# Altium project Carrier-Board-v1.0.PrjPcb (part 9 of 15)

## Sheet WIFI_BLUETOOTH_SHEET.SchDoc
size A4; SheetNumber: 15; SheetTotal: 27
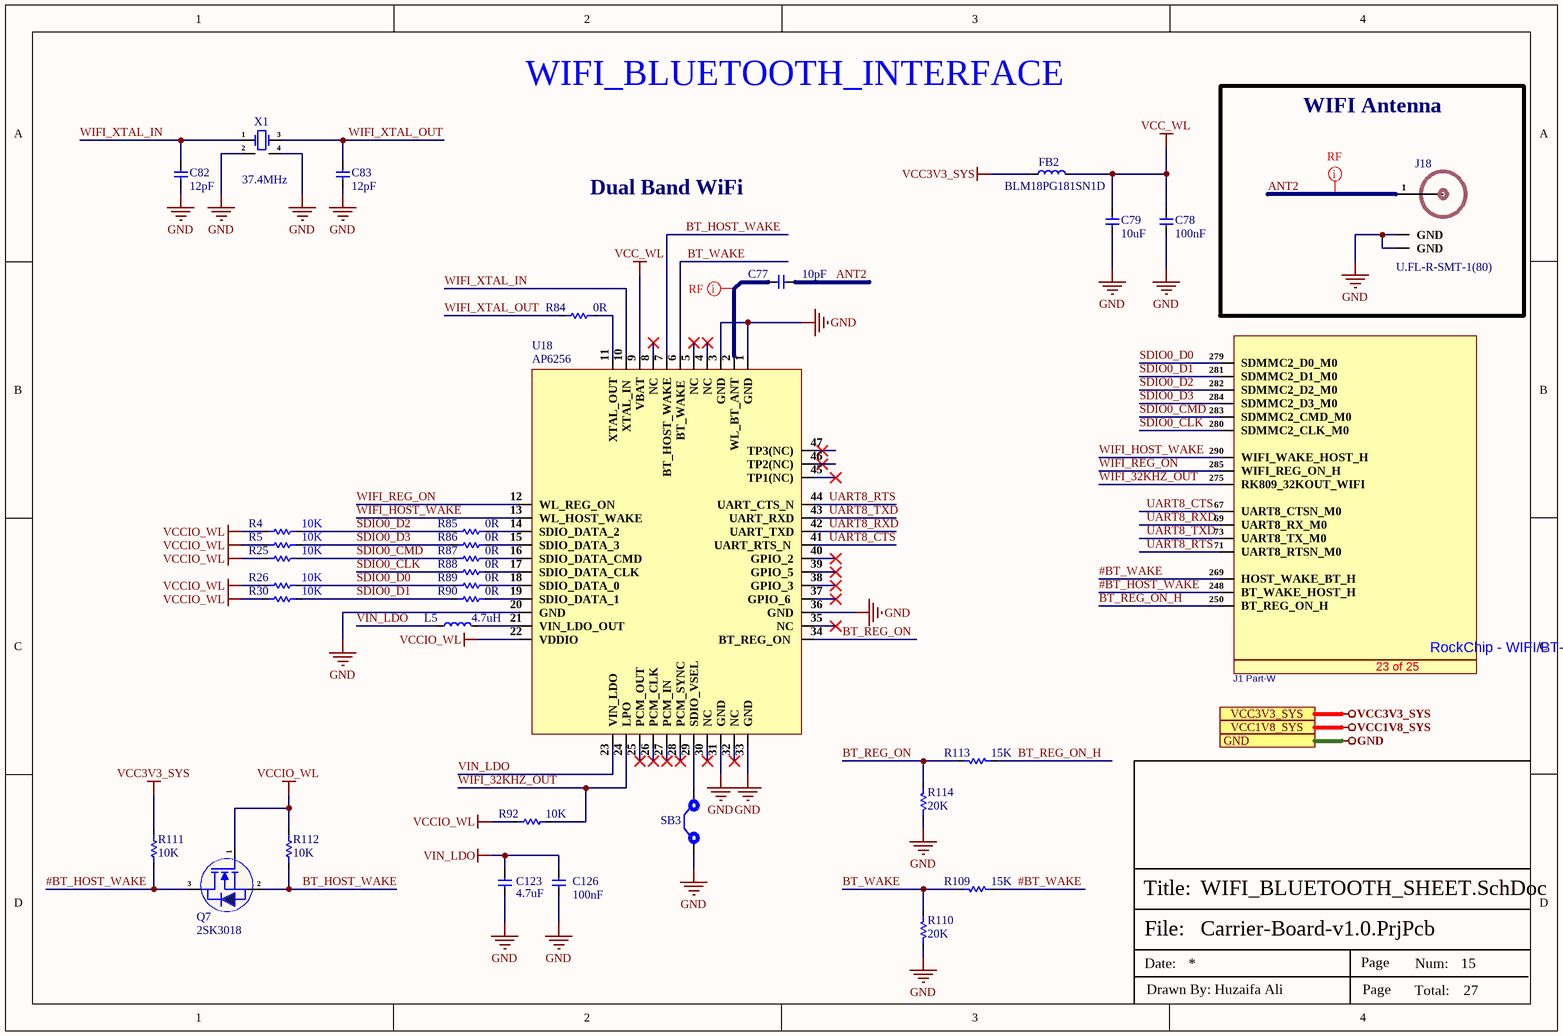
[diagram p14: WIFI_BLUETOOTH_SHEET.SchDoc]

### Parts
C77  10pF  [Cap-0402]
C78  100nF  [Cap-0402]
C79  10uF  [Cap-0402]
C82  12pF  [Cap-0402]
C83  12pF  [Cap-0402]
C123  4.7uF  [Cap-0402]
C126  100nF  [Cap-0402]
FB2  BLM18PG181SN1D  [IND-0603 (1608 Metric)]
J1_Part-  AS0B826-S78B-7H  [AS0B826-S78B-7H]  (value not drawn)  (part W of 25)
J18  U.FL-R-SMT-1(80)  [U.FL-R-SMT-1(80)_]
L5  4.7uH  [SWPA4030S4R7MT_]
Q7  2SK3018  [SOT-23]
R4  10K  [Res-0402]
R5  10K  [Res-0402]
R25  10K  [Res-0402]
R26  10K  [Res-0402]
R30  10K  [Res-0402]
R84  0R  [Res-0402]
R85  0R  [Res-0402]
R86  0R  [Res-0402]
R87  0R  [Res-0402]
R88  0R  [Res-0402]
R89  0R  [Res-0402]
R90  0R  [Res-0402]
R92  10K  [Res-0402]
R109  15K  [Res-0402]
R110  20K  [Res-0402]
R111  10K  [Res-0402]
R112  10K  [Res-0402]
R113  15K  [Res-0402]
R114  20K  [Res-0402]
SB3  Solder Bridge 0402  [Solder Bridge 0402]  (value not drawn)  (no BOM)
U18  AP6256  [AP6256_]
X1  37.4MHz  [Q22FA12800078_]

### Blocks framed on the sheet
WIFI Antenna: J18

### Ports
GND (see TOP SHEET[3C], AUDIO_INTERFACE[1D], BUCK REGULATOR[3D], DEBUG_UART_INTERFACE[3D], DIGITAL IO_RELAY_SHEET[5D], DUAL_SIM_INTERFACE[3D], ETHERNET_PHY0[4D], ETHERNET_PHY1[4D], GSM_INTERFACE[2D], HDMI_INTERFACE[3D], INPUT_PROTECTION[3D], LINEAR_VOLTAGE_REG[3D], MICRO_SD_INTERFACE[3D], MIPI-DSI DISPLAY[3D], POWER SECTION[3D], PUSH BUTTONs_INTERFACE[3C], RGB_LEDs_INTERFACE[3D], ROCKCHIP_PWR_SUPPLY[1D], ROCKCHIP_SYSTEM_CONTROL[3C], RS232_RS485_INTERFACE[3C], SENSOR_SHEET[3D], USB2.0_INTERFACE[3D], USB3.0_INTERFACE[3D], USB-C_INTERFACE[2D], WIEGAND_INTERFACE[3D]), VCC1V8_SYS (see TOP SHEET[3C], ETHERNET_PHY0[4D], ETHERNET_PHY1[4D], LINEAR_VOLTAGE_REG[3D], POWER SECTION[3D], ROCKCHIP_PWR_SUPPLY[1D]), VCC3V3_SYS (see TOP SHEET[3C], AUDIO_INTERFACE[1D], BUCK REGULATOR[3D], DEBUG_UART_INTERFACE[3D], DIGITAL IO_RELAY_SHEET[5D], ETHERNET_PHY0[4D], ETHERNET_PHY1[4D], GSM_INTERFACE[2D], HDMI_INTERFACE[3D], LINEAR_VOLTAGE_REG[3D], MIPI-DSI DISPLAY[3D], POWER SECTION[3D], PUSH BUTTONs_INTERFACE[3C], ROCKCHIP_PWR_SUPPLY[1D], ROCKCHIP_SYSTEM_CONTROL[3C], RS232_RS485_INTERFACE[3C], SENSOR_SHEET[3D], USB-C_INTERFACE[2D], WIEGAND_INTERFACE[3D])

### Nets
GND: C78.1 C79.1 C82.1 C83.1 C123.1 C126.1 J18.2(GND) J18.3(GND) R110.1 R114.1 SB3.2 U18.1(GND) U18.3(GND) U18.20(GND) U18.31(GND) U18.33(GND) U18.36(GND) X1.2(GND) X1.4(GND) ; port GND
VCC3V3_SYS: FB2.1 R111.2 ; port VCC3V3_SYS
VCC_WL: C78.2 C79.2 FB2.2 U18.9(VBAT)
VCCIO_WL: Q7.1(G) R4.2 R5.2 R25.2 R26.2 R30.2 R92.2 R112.2 U18.22(VDDIO)
VIN_LDO: C123.2 C126.2 L5.1 U18.23(VIN_LDO)
#BT_HOST_WAKE: J1_Part-.248(BT_WAKE_HOST_H) Q7.3(D) R111.1
#BT_WAKE: J1_Part-.269(HOST_WAKE_BT_H) R109.1
ANT2: C77.2 J18.1(RF_IN)
BT_HOST_WAKE: Q7.2(S) R112.1 U18.7(BT_HOST_WAKE)
BT_REG_ON: R113.2 R114.2 U18.34(BT_REG_ON)
BT_REG_ON_H: J1_Part-.250(BT_REG_ON_H) R113.1
BT_WAKE: R109.2 R110.2 U18.6(BT_WAKE)
SDIO0_CLK: J1_Part-.280(SDMMC2_CLK_M0) R88.1
SDIO0_CMD: J1_Part-.283(SDMMC2_CMD_M0) R25.1 R87.1
SDIO0_D0: J1_Part-.279(SDMMC2_D0_M0) R26.1 R89.1
SDIO0_D1: J1_Part-.281(SDMMC2_D1_M0) R30.1 R90.1
SDIO0_D2: J1_Part-.282(SDMMC2_D2_M0) R4.1 R85.1
SDIO0_D3: J1_Part-.284(SDMMC2_D3_M0) R5.1 R86.1
UART8_CTS: J1_Part-.67(UART8_CTSN_M0) U18.41(UART_RTS_N)
UART8_RTS: J1_Part-.71(UART8_RTSN_M0) U18.44(UART_CTS_N)
UART8_RXD: J1_Part-.69(UART8_RX_M0) U18.42(UART_TXD)
UART8_TXD: J1_Part-.73(UART8_TX_M0) U18.43(UART_RXD)
WIFI_32KHZ_OUT: J1_Part-.275(RK809_32KOUT_WIFI) R92.1 U18.24(LPO)
WIFI_HOST_WAKE: J1_Part-.290(WIFI_WAKE_HOST_H) U18.13(WL_HOST_WAKE)
WIFI_REG_ON: J1_Part-.285(WIFI_REG_ON_H) U18.12(WL_REG_ON)
WIFI_XTAL_IN: C82.2 U18.10(XTAL_IN) X1.1(OSC1)
WIFI_XTAL_OUT: C83.2 R84.1 X1.3(OSC2)
NetC77_1: C77.1 U18.2(WL_BT_ANT)
NetL5_2: L5.2 U18.21(VIN_LDO_OUT)
NetR84_2: R84.2 U18.11(XTAL_OUT)
NetR85_2: R85.2 U18.14(SDIO_DATA_2)
NetR86_2: R86.2 U18.15(SDIO_DATA_3)
NetR87_2: R87.2 U18.16(SDIO_DATA_CMD)
NetR88_2: R88.2 U18.17(SDIO_DATA_CLK)
NetR89_2: R89.2 U18.18(SDIO_DATA_0)
NetR90_2: R90.2 U18.19(SDIO_DATA_1)
NetSB3_1: SB3.1 U18.29(SDIO_VSEL)

Not connected (* = marked no-connect by the designer): U18 4(NC)* 5(NC)* 8(NC)* 25(PCM_OUT)* 26(PCM_CLK)* 27(PCM_IN_)* 28(PCM_SYNC_)* 30(NC)* 32(NC_)* 35(NC)* 37(GPIO_6_)* 38(GPIO_3)* 39(GPIO_5)* 40(GPIO_2)* 45(TP1(NC))* 46(TP2(NC))* 47(TP3(NC))*

### Layout directives
net class RF: ANT2, NetC77_1

### Notes on the sheet
- WIFI_BLUETOOTH_INTERFACE
- Dual Band WiFi
- File:
- Title:
- Date:
- Page
- Num:
- Total:
- Drawn By: Huzaifa Ali
- (in symbol AS0B826-S78B-7H, part W) RockChip - WIFI/BT-SDIO; 23 of 25

### Library data of the parts
C77 = GRM1555C1H100JA01D: CAP CER 10PF 50V C0G/NP0 0402; Manufacturer: Murata; Tolerance: 5%; Material: Ceramic; Dielectric: C0G; Item Type: Capacitor; Manufacturer Part Number: GRM1555C1H100JA01D; RoHS: Yes; Category: Ceramic Capacitors; Case/Package: 0402; Case Code (Imperial): 0402; Case Code (Metric): 1005; Min Operating Temperature: -55°C; Max Operating Temperature: 125°C; Packaging: Tape and Reel; Voltage Rating: 50V; RoHS Compliant: Yes; ComponentLink1URL: https://datasheet.ciiva.com/2989/product-2989280.pdf?src-supplier=Avnet; ComponentLink1Description: https://datasheet.ciiva.com/2989/product-2989280.pdf?src-supplier=Avnet; Supplier: Arrow Electronics; Supplier Part Number: GRM1555C1H100JA01D; Stock: 3860000; Pricing: 10000=0.0034, 50000=0.0027, 100000=0.0023, 250000=0.0021 (USD); Mounting Technology: Surface Mount; Value: 10pF; Package Quantity: 1; Voltage Rating (DC): 50V; Termination: SMD/SMT; Series: GRM; Voltage: 50V; Construction: Flat; Length: 1mm; Width: 0.02inch; Height: 0.5mm; Depth: 0.5mm; Thickness: 0.022inch; Radiation Hardening: No; Lead Free: Lead Free; Reach SVHC Compliant: No; ComponentLink2URL: https://datasheet.ciiva.com/18184/getdatasheetpartid-307234-18184164.pdf?src-supplier=Verical; ComponentLink2Description: https://datasheet.ciiva.com/18184/getdatasheetpartid-307234-18184164.pdf?src-supplier=Verical; ComponentLink3URL: https://datasheet.ciiva.com/29200/453545-da-01-en-vs-kondensator-0402-29200107.pdf?src-supplier=Conrad; ComponentLink3Description: https://datasheet.ciiva.com/29200/453545-da-01-en-vs-kondensator-0402-29200107.pdf?src-supplier=Conrad; ComponentLink4URL: https://datasheet.ciiva.com/7828/1666664-7828812.pdf?src-supplier=Element14; ComponentLink4Description: https://datasheet.ciiva.com/7828/1666664-7828812.pdf?src-supplier=Element14; ComponentLink5URL: https://datasheet.ciiva.com/6271/partnumbering-e-01-6271159.pdf?src-supplier=Digi-Key; ComponentLink5Description: https://datasheet.ciiva.com/6271/partnumbering-e-01-6271159.pdf?src-supplier=Digi-Key; ComponentLink6URL: https://datasheet.ciiva.com/6271/partnumbering-e-01-6271158.pdf?src-supplier=Digi-Key; ComponentLink6Description: https://datasheet.ciiva.com/6271/partnumbering-e-01-6271158.pdf?src-supplier=Digi-Key; ComponentLink7URL: https://datasheet.ciiva.com/6271/partnumbering-e-01-6271068.pdf?src-supplier=Digi-Key; ComponentLink7Description: https://datasheet.ciiva.com/6271/partnumbering-e-01-6271068.pdf?src-supplier=Digi-Key; LCSC Part Number: C76946
C78 C126 = CC0402KRX5R7BB104: CAP CER 0.1UF 16V X5R 0402; Manufacturer: Yageo; Tolerance: 10%; Supplier 1: Mouser; Manufacturer Part Number: CC0402KRX5R7BB104; RoHS: Yes; Category: Ceramic Capacitors; Stock 1: 936792; Pricing 1: 1=0.10000, 10=0.02300, 50=0.02300, 100=0.01100, 1000=0.00600, 10000=0.00400 (USD); Mount: Surface Mount; Case/Package: 0402; Case Code (Imperial): 0402; Case Code (Metric): 1005; Min Operating Temperature: -55°C; Max Operating Temperature: 85°C; Capacitance: 100nF; Packaging: Tape and Reel; Voltage Rating: 16V; Dielectric: X5R; Termination: SMD/SMT; Voltage Rating (DC): 16V; Package Quantity: 1; Length: 1mm; Width: 0.02inch; Thickness: 0.022inch; Lead Free: Lead Free; Halogen Free: Halogen Free; ComponentLink1URL: https://datasheet.ciiva.com/155/mlccorderingcode-155879.pdf?src-supplier=Digi-Key; ComponentLink1Description: https://datasheet.ciiva.com/155/mlccorderingcode-155879.pdf?src-supplier=Digi-Key; ComponentLink2URL: https://datasheet.ciiva.com/155/mlccorderingcode-155878.pdf?src-supplier=Digi-Key; ComponentLink2Description: https://datasheet.ciiva.com/155/mlccorderingcode-155878.pdf?src-supplier=Digi-Key; ComponentLink3URL: https://datasheet.ciiva.com/155/mlccorderingcode-155880.pdf?src-supplier=Digi-Key; ComponentLink3Description: https://datasheet.ciiva.com/155/mlccorderingcode-155880.pdf?src-supplier=Digi-Key; Supplier Part Number 1: 603-CC402KRX5R7BB104; LCSC Part Number: C106204; Number of Pins: 2; Resistor Type: Ceramic; Series: CC; Construction: Flat; Height: 0.5mm; Depth: 0.5mm; Radiation Hardening: No; REACH SVHC: Unknown; RoHS Compliant: Yes; ComponentLink4URL: https://datasheet.ciiva.com/11464/upy-gphc-x5r-4v-to-50v-12-11464869.pdf?src-supplier=Avnet; ComponentLink4Description: https://datasheet.ciiva.com/11464/upy-gphc-x5r-4v-to-50v-12-11464869.pdf?src-supplier=Avnet
C79 = CC0402MRX5R6BB106: CAP CER 10UF 10V X5R 0402; Manufacturer: Yageo; Tolerance: 20%; Item Type: Capacitor; Supplier 1: Future Electronics; Manufacturer Part Number: CC0402MRX5R6BB106; RoHS: Yes; Category: Ceramic Capacitors; Stock 1: 80000; Pricing 1: 10000=0.02650, 20000=0.02590, 30000=0.02550, 40000=0.02530, 50000=0.02450 (USD); Mount: Surface Mount; Case/Package: 0402; Case Code (Imperial): 0402; Case Code (Metric): 1005; Min Operating Temperature: -55°C; Max Operating Temperature: 85°C; Packaging: Tape and Reel; Capacitance: 10uF; Voltage Rating: 10V; RoHS Compliant: Yes; ComponentLink1URL: http://www.yageo.com/documents/recent/UPY-GPHC_X5R_4V-to-50V_25.pdf?src-supplier=Digi-Key; ComponentLink1Description: http://www.yageo.com/documents/recent/UPY-GPHC_X5R_4V-to-50V_25.pdf?src-supplier=Digi-Key; Supplier Part Number 1: 6097631; LCSC Part Number: C962143
C82 C83 = GJM1555C1H120GB01D: CAP CER 12PF 50V C0G/NP0 0402; Manufacturer: Murata; Tolerance: 2%; Dielectric: C0G; Supplier 1: Digi-Key; Manufacturer Part Number: GJM1555C1H120GB01D; RoHS: Yes; Category: Ceramic Capacitors; Stock 1: 266975; Pricing 1: 1=0.18000, 10=0.12600, 50=0.07560, 100=0.06390, 500=0.04370, 1000=0.03865, 2500=0.03698, 5000=0.03361 (USD); Mount: Surface Mount; Case/Package: 0402; Case Code (Imperial): 0402; Case Code (Metric): 1005; Min Operating Temperature: -55°C; Max Operating Temperature: 125°C; Capacitance: 12pF; Voltage Rating: 50V; Voltage Rating (DC): 50V; Packaging: Tape and Reel; Package Quantity: 10000; Termination: SMD/SMT; Series: GJM; Construction: Flat; Length: 1mm; Width: 0.5mm; Height: 0.5mm; Thickness: 0.022inch; Depth: 0.5mm; Radiation Hardening: No; Lead Free: Lead Free; RoHS Compliant: Yes; ComponentLink1URL: https://datasheet.ciiva.com/11608/product-11608208.pdf?src-supplier=Avnet; ComponentLink1Description: https://datasheet.ciiva.com/11608/product-11608208.pdf?src-supplier=Avnet; ComponentLink2URL: https://datasheet.ciiva.com/29542/partnumbering-e-01-29542716.pdf?src-supplier=Digi-Key; ComponentLink2Description: https://datasheet.ciiva.com/29542/partnumbering-e-01-29542716.pdf?src-supplier=Digi-Key; ComponentLink3URL: https://datasheet.ciiva.com/29542/partnumbering-e-01-29542715.pdf?src-supplier=Digi-Key; ComponentLink3Description: https://datasheet.ciiva.com/29542/partnumbering-e-01-29542715.pdf?src-supplier=Digi-Key; ComponentLink4URL: https://datasheet.ciiva.com/29542/partnumbering-e-01-29542717.pdf?src-supplier=Digi-Key; ComponentLink4Description: https://datasheet.ciiva.com/29542/partnumbering-e-01-29542717.pdf?src-supplier=Digi-Key; Supplier Part Number 1: 490-8078-1-ND; LCSC Part Number: C161305
C123 = CC0402KRX5R6BB475: CAP CER 4.7UF 10V X5R 0402; Manufacturer: Yageo; Tolerance: 10%; Supplier 1: Farnell; Manufacturer Part Number: CC0402KRX5R6BB475; RoHS: Yes; Category: Ceramic Capacitors; Stock 1: 20000; Pricing 1: 10000=0.02310, 50000=0.02100 (GBP); RoHS Compliant: Yes; Supplier Part Number 1: 3871698; LCSC Part Number: C326586; ComponentLink1Description: http://www.yageo.com/documents/recent/UPY-GPHC_X5R_4V-to-50V_25.pdf?src-supplier=Digi-Key; ComponentLink1URL: http://www.yageo.com/documents/recent/UPY-GPHC_X5R_4V-to-50V_25.pdf?src-supplier=Digi-Key; Mount: Surface Mount; Case/Package: 0402; Case Code (Imperial): 0402; Case Code (Metric): 1005; Min Operating Temperature: -55°C; Max Operating Temperature: 85°C; Packaging: Cut Tape; Capacitance: 4.7uF; Voltage Rating: 10V
FB2 = BLM18PG181SN1D: 0603 180Ω ±25% DCR=0.09Ω 1.5A; Manufacturer: Murata; Manufacturer Series: BLM18P; Core Material: Ferrite; Material: Ferrite,Steel; Impedance: 180R; Number of Lines: 1; DC Resistance (DCR): 90mR; Test Frequency: 100MHz; Shielding: Unshielded; Item Type: Ferrite Bead; Supplier 1: Arrow Electronics; Manufacturer Part Number: BLM18PG181SN1D; RoHS: Yes; Category: Inductors; Stock 1: 13; Pricing 1: 1=0.08740, 10=0.06280 (USD); Case/Package: 0603; Number of Pins: 2; Case Code (Metric): 1608; Case Code (Imperial): 0603; Terminal Finish: Tin; Min Operating Temperature: -55°C; Max Operating Temperature: 125°C; Package Quantity: 1; Tolerance: 25%; Packaging: Tape and Reel; Current Rating: 1.5A; Max Current Rating: 1.5A; Max DC Current: 1.5A; Termination: SMD/SMT; DC Current: 1.5A; Number of Circuits: 1; Series: BLM18P; Number of Functions: 1; DC Resistance-Max: 90mR; Length: 1.6mm; Width: 0.8mm; Height: 0.8mm; Depth: 0.8mm; Radiation Hardening: No; REACH SVHC: No SVHC; Lead Free: Lead Free; RoHS Compliant: Yes; ComponentLink1URL: https://datasheet.ciiva.com/36526/1845021-36526048.pdf?src-supplier=Jameco; ComponentLink1Description: https://datasheet.ciiva.com/36526/1845021-36526048.pdf?src-supplier=Jameco; ComponentLink2URL: https://datasheet.ciiva.com/11800/0900766b81275ca5-11800854.pdf?src-supplier=RSComponents; ComponentLink2Description: https://datasheet.ciiva.com/11800/0900766b81275ca5-11800854.pdf?src-supplier=RSComponents; ComponentLink3URL: https://datasheet.ciiva.com/29347/442378-da-01-en-chip-drossel-0603-180r-1500ma-1-6x0-8mm-29347913.pdf?src-supplier=Conrad; ComponentLink3Description: https://datasheet.ciiva.com/29347/442378-da-01-en-chip-drossel-0603-180r-1500ma-1-6x0-8mm-29347913.pdf?src-supplier=Conrad; ComponentLink4URL: https://datasheet.ciiva.com/8021/5148-8021478.pdf?src-supplier=Element14; ComponentLink4Description: https://datasheet.ciiva.com/8021/5148-8021478.pdf?src-supplier=Element14; ComponentLink5URL: https://datasheet.ciiva.com/8021/5148-8021496.pdf?src-supplier=Element14; ComponentLink5Description: https://datasheet.ciiva.com/8021/5148-8021496.pdf?src-supplier=Element14; ComponentLink6URL: https://datasheet.ciiva.com/1012/l0110s0100blm18p-1012153.pdf?src-supplier=Digi-Key; ComponentLink6Description: https://datasheet.ciiva.com/1012/l0110s0100blm18p-1012153.pdf?src-supplier=Digi-Key; ComponentLink7URL: https://datasheet.ciiva.com/1012/l0110s0100blm18p-1012152.pdf?src-supplier=Digi-Key; ComponentLink7Description: https://datasheet.ciiva.com/1012/l0110s0100blm18p-1012152.pdf?src-supplier=Digi-Key; ComponentLink8URL: https://datasheet.ciiva.com/1012/l0110s0100blm18p-1012154.pdf?src-supplier=Digi-Key; ComponentLink8Description: https://datasheet.ciiva.com/1012/l0110s0100blm18p-1012154.pdf?src-supplier=Digi-Key; ComponentLink9URL: https://datasheet.ciiva.com/8084/l0110s0100blm18p-8084296.pdf?src-supplier=Avnet; ComponentLink9Description: https://datasheet.ciiva.com/8084/l0110s0100blm18p-8084296.pdf?src-supplier=Avnet; ComponentLink10URL: https://datasheet.ciiva.com/16394/l0110s0100blm18p-16394029.pdf?src-supplier=Future+Electronics; ComponentLink10Description: https://datasheet.ciiva.com/16394/l0110s0100blm18p-16394029.pdf?src-supplier=Future+Electronics; Supplier Part Number 1: BLM18PG181SN1D; LCSC Part Number: C82850
J1_Part- = AS0B826-S78B-7H: SMD,P=0.5mm,Surface Mount，Right Angle; Manufacturer: FOXCONN; Item Type: Card Edge Connectors; Supplier: LCSC; Manufacturer Part Number: AS0B826-S78B-7H; RoHS: No; Stock: 4979; Pricing: 1=9.21, 10=8.287, 25=7.8064, 50=7.6064, 100=7.4062 (USD); LCSC Part Number: C426232
J18 = U.FL-R-SMT-1(80): CONN U.FL RCPT STR 50 OHM SMD; Manufacturer: Hirose; Item Type: UFL Connector; Supplier 1: Future Electronics; Manufacturer Part Number: U.FL-R-SMT-1(80); Stock 1: 1272; Pricing 1: 1=1.07, 500=0.785, 1500=0.74, 2500=0.72, 5000=0.695 (USD); Case/Package: SMD/SMT; Package Quantity: 10000; Packaging: Tape and Reel; Lead Free: Lead Free; ComponentLink1URL: https://www.hirose.com/product/en/download_file/key_name/U.FL-R-SMT-1%2880%29/category/Specification%20Sheet/doc_file_id/37638/?file_category_id=9&item_id=03310472280&is_series=&src-supplier=Digi-Key; ComponentLink1Description: https://www.hirose.com/product/en/download_file/key_name/U.FL-R-SMT-1%2880%29/category/Specification%20Sheet/doc_file_id/37638/?file_category_id=9&item_id=03310472280&is_series=&src-supplier=Digi-Key; ComponentLink2URL: http://www.mouser.com/ds/2/185/U.FL_catalog-939761.pdf?src-supplier=Mouser; ComponentLink2Description: http://www.mouser.com/ds/2/185/U.FL_catalog-939761.pdf?src-supplier=Mouser; Supplier Part Number 1: U.FL-R-SMT-1(80)-CUTT; LCSC Part Number: C88374
L5 = SWPA4030S4R7MT: Fixed Ind 4.720%UH 0.06 Ohm 3200M; Manufacturer: Sunlord; Supplier 1: Digi-Key; Manufacturer Part Number: SWPA4030S4R7MT; RoHS: Yes; Category: Fixed Inductors; Stock 1: 3730; Pricing 1: 1=0.44000, 10=0.38900, 25=0.36120, 50=0.30560, 100=0.27780, 250=0.26108, 500=0.23332, 1000=0.18887 (USD); RoHS Compliant: Yes; Supplier Part Number 1: 3442-SWPA4030S4R7MTCT-ND; LCSC Part Number: C57269
Q7 = 2SK3018: 30V 100mA 200mW 8Ω@4V,10mA N Channel SOT-23 MOSFETs ROHS; Manufacturer: KUU; Item Type: MOSFET; Manufacturer Part Number: 2SK3018; Package: SOT-23; LCSC Part Number: C2944164; ComponentLink1Description: LCSC; ComponentLink1URL: https://www.lcsc.com/product-detail/MOSFETs_KUU-2SK3018_C2944164.html
R4 R5 R25 R26 R30 R92 R111 R112 = RC0402FR-0710KL: RES 10K OHM 1% 1/16W 0402; Manufacturer: Yageo; Max Power Dissipation: 63mW; Temperature Coefficient: 100ppm/°C; Resistance: 10kR; Voltage Rating (DC): 50V; Power Rating: 62.5mW; Item Type: Resistor; Manufacturer Part Number: RC0402FR-0710KL; RoHS: Yes; Category: Chip SMD Resistors; Case/Package: 0402; Case Code (Imperial): 0402; Case Code (Metric): 1005; Min Operating Temperature: -55°C; Max Operating Temperature: 155°C; Features: Moisture Resistant; Packaging: Tape and Reel; Tolerance: 1%; Number of Terminations: 2; Series: RC; RoHS Compliant: Yes; ComponentLink1URL: https://datasheet.ciiva.com/7660/38568-7660787.pdf?src-supplier=Element14; ComponentLink1Description: https://datasheet.ciiva.com/7660/38568-7660787.pdf?src-supplier=Element14; Supplier 1: Mouser; Stock 1: 18648329; Pricing 1: 1=0.10000, 10=0.01400, 50=0.01400, 100=0.00500, 1000=0.00300, 10000=0.00200 (USD); Number of Pins: 2; Resistor Type: Thick Film; Voltage Rating: 50V; Termination: SMD/SMT; Resistance Tolerance: 1%; Construction: Rectangular; Length: 1mm; Width: 0.5mm; Height: 0.32mm; Depth: 0.5mm; Lead Pitch: 0.2mm; REACH SVHC: No SVHC; Lead Free: Lead Free; Military Standard: Not; ComponentLink2URL: https://datasheet.ciiva.com/7849/1686128-7849814.pdf?src-supplier=Element14; ComponentLink2Description: https://datasheet.ciiva.com/7849/1686128-7849814.pdf?src-supplier=Element14; ComponentLink3URL: https://datasheet.ciiva.com/7983/1018594-7983486.pdf?src-supplier=Element14; ComponentLink3Description: https://datasheet.ciiva.com/7983/1018594-7983486.pdf?src-supplier=Element14; ComponentLink4URL: https://datasheet.ciiva.com/22747/1018594-22747512.pdf?src-supplier=Element14; ComponentLink4Description: https://datasheet.ciiva.com/22747/1018594-22747512.pdf?src-supplier=Element14; ComponentLink5URL: https://datasheet.ciiva.com/12667/pyu-rc0402-51-rohs-l-6-r-12667067.pdf?src-supplier=Mouser; ComponentLink5Description: https://datasheet.ciiva.com/12667/pyu-rc0402-51-rohs-l-6-r-12667067.pdf?src-supplier=Mouser; ComponentLink6URL: https://datasheet.ciiva.com/7849/1784430-7849813.pdf?src-supplier=Element14; ComponentLink6Description: https://datasheet.ciiva.com/7849/1784430-7849813.pdf?src-supplier=Element14; Supplier Part Number 1: 603-RC0402FR-0710KL; LCSC Part Number: C60490; Working Voltage: 50V; ComponentLink7URL: https://datasheet.ciiva.com/7849/1784430-7849815.pdf?src-supplier=Element14; ComponentLink7Description: https://datasheet.ciiva.com/7849/1784430-7849815.pdf?src-supplier=Element14
R84 = RC0402FR-070RL: RES 0 OHM JUMPER 1/16W 0402; Manufacturer: Yageo; Tolerance: 1%; Power Rating: 62.5mW; Voltage Rating: 50V; Temperature Coefficient: 200ppm/°C; Max Power Dissipation: 63mW; Supplier 1: Mouser; Manufacturer Part Number: RC0402FR-070RL; RoHS: Yes; Category: Chip SMD Resistors; Stock 1: 8556842; Pricing 1: 1=0.10000, 10=0.01400, 50=0.01400, 100=0.00600, 1000=0.00300, 5000=0.00200, 10000=0.00100 (USD); Mount: Surface Mount; Case/Package: 0402; Contact Plating: Tin,Matte; Case Code (Imperial): 0402; Case Code (Metric): 1005; Size Code: 0402; Min Operating Temperature: -55°C; Max Operating Temperature: 155°C; Resistance: 0R; Resistor Type: Thick Film; Packaging: Tape and Reel; Termination: SMD/SMT; Features: Moisture Resistant; Series: RC; Number of Terminations: 2; Length: 1mm; Width: 0.5mm; Height: 0.35mm; Radiation Hardening: No; Lead Free: Lead Free; RoHS Compliant: Yes; ComponentLink1URL: https://datasheet.ciiva.com/8896/pyu-rc0402-51-rohs-l-6-8896149.pdf?src-supplier=Avnet; ComponentLink1Description: https://datasheet.ciiva.com/8896/pyu-rc0402-51-rohs-l-6-8896149.pdf?src-supplier=Avnet; ComponentLink2URL: https://datasheet.ciiva.com/16790/pyu-rc0402-51-rohs-l-6-r-16790444.pdf?src-supplier=Future+Electronics; ComponentLink2Description: https://datasheet.ciiva.com/16790/pyu-rc0402-51-rohs-l-6-r-16790444.pdf?src-supplier=Future+Electronics; Supplier Part Number 1: 603-RC0402FR-070RL; LCSC Part Number: C106231
R85-R90 = RC0402FR-070RL: RES 0 OHM JUMPER 1/16W 0402; Manufacturer: Yageo; Power Rating: 62.5mW; Tolerance: 1%; Voltage Rating: 50V; Temperature Coefficient: 200ppm/°C; Max Power Dissipation: 63mW; Supplier 1: Mouser; Manufacturer Part Number: RC0402FR-070RL; RoHS: Yes; Category: Chip SMD Resistors; Stock 1: 8556842; Pricing 1: 1=0.10000, 10=0.01400, 50=0.01400, 100=0.00600, 1000=0.00300, 5000=0.00200, 10000=0.00100 (USD); Case/Package: 0402; Case Code (Imperial): 0402; Case Code (Metric): 1005; Size Code: 0402; Min Operating Temperature: -55°C; Max Operating Temperature: 155°C; Resistor Type: Thick Film; Resistance: 0R; Packaging: Tape and Reel; Termination: SMD/SMT; Features: Moisture Resistant; Series: RC; Number of Terminations: 2; Length: 1mm; Width: 0.5mm; Height: 0.35mm; RoHS Compliant: Yes; Lead Free: Lead Free; ComponentLink1URL: https://datasheet.ciiva.com/8896/pyu-rc0402-51-rohs-l-6-8896149.pdf?src-supplier=Avnet; ComponentLink1Description: https://datasheet.ciiva.com/8896/pyu-rc0402-51-rohs-l-6-8896149.pdf?src-supplier=Avnet; ComponentLink2URL: https://datasheet.ciiva.com/16790/pyu-rc0402-51-rohs-l-6-r-16790444.pdf?src-supplier=Future+Electronics; ComponentLink2Description: https://datasheet.ciiva.com/16790/pyu-rc0402-51-rohs-l-6-r-16790444.pdf?src-supplier=Future+Electronics; Supplier Part Number 1: 603-RC0402FR-070RL; LCSC Part Number: C106231; Mount: Surface Mount; Contact Plating: Tin,Matte; Radiation Hardening: No
R109 R113 = RC0402FR-0715KL: RES 15K OHM 1% 1/16W 0402; Manufacturer: Yageo; Item Type: Resistor; Power Rating: 62.5mW; Value: 15kR; Voltage Rating: 50V; Temperature Coefficient: 100ppm/°C; Max Power Dissipation: 63mW; Manufacturer Part Number: RC0402FR-0715KL; RoHS: Yes; LCSC Part Number: C114761; Supplier: Future Electronics; Supplier Part Number: 3262151; Stock: 1530000; Pricing: 10000=0.0012, 100000=0.0011, 300000=0.001, 750000=0.001, 2000000=0.0009 (USD); ComponentLink1URL: https://datasheet.ciiva.com/11808/0900766b80c66297-11808307.pdf?src-supplier=Rs; ComponentLink1Description: https://datasheet.ciiva.com/11808/0900766b80c66297-11808307.pdf?src-supplier=Rs; ComponentLink2URL: https://datasheet.ciiva.com/46394/1018594-46394949.pdf?src-supplier=Element14; ComponentLink2Description: https://datasheet.ciiva.com/46394/1018594-46394949.pdf?src-supplier=Element14; Case/Package: 0402; Pins: 2NUMBER; Case Code (Imperial): 0402; Case Code (Metric): 1005; Weight: 2.3E-05oz; Min Operating Temperature: -55°C; Max Operating Temperature: 155°C; Resistor Type: Thick Film; Tolerance: 1%; Packaging: Tape and Reel; Package Quantity: 1; Termination: SMD/SMT; Number of Terminations: 2; Features: Moisture Resistant; Series: RC; Resistance Tolerance: 1%; Technology: THICK FILM; Construction: Rectangular; Voltage Rating (DC): 50V; Length: 1mm; Width: 0.02inch; Height: 0.016inch; Depth: 0.5mm; RoHS Compliant: Yes; Reach SVHC Compliant: No; Military Standard: Not; Lead Free: 5697LeadFree; ComponentLink3URL: https://datasheet.ciiva.com/2453/pyu-r-int-thick-7-2453404.pdf?src-supplier=Digikey; ComponentLink3Description: https://datasheet.ciiva.com/2453/pyu-r-int-thick-7-2453404.pdf?src-supplier=Digikey; ComponentLink4URL: https://datasheet.ciiva.com/2453/pyu-r-int-thick-7-2453405.pdf?src-supplier=Digikey; ComponentLink4Description: https://datasheet.ciiva.com/2453/pyu-r-int-thick-7-2453405.pdf?src-supplier=Digikey; ComponentLink5URL: https://datasheet.ciiva.com/2453/pyu-r-int-thick-7-2453403.pdf?src-supplier=Digikey; ComponentLink5Description: https://datasheet.ciiva.com/2453/pyu-r-int-thick-7-2453403.pdf?src-supplier=Digikey; ComponentLink6URL: https://datasheet.ciiva.com/12577/pyu-rc0402-51-rohs-l-6-r-12577610.pdf?src-supplier=Mouser; ComponentLink6Description: https://datasheet.ciiva.com/12577/pyu-rc0402-51-rohs-l-6-r-12577610.pdf?src-supplier=Mouser; ComponentLink7URL: https://datasheet.ciiva.com/17333/pyu-rc0402-51-rohs-l-6-r-17333595.pdf?src-supplier=Future+Electronics; ComponentLink7Description: https://datasheet.ciiva.com/17333/pyu-rc0402-51-rohs-l-6-r-17333595.pdf?src-supplier=Future+Electronics
R110 R114 = RC0402FR-0720KL: RES 20K OHM 1% 1/16W 0402; Manufacturer: Yageo; Resistance: 20kR; Power Rating: 62.5mW; Voltage Rating: 50V; Temperature Coefficient: 100ppm/°C; Max Power Dissipation: 63mW; Item Type: Resistor; Supplier 1: Avnet; Manufacturer Part Number: RC0402FR-0720KL; RoHS: Yes; Category: Chip SMD Resistors; Stock 1: 1960708; Pricing 1: 10000=0.00085 (USD); Case/Package: 0402; Number of Pins: 2; Case Code (Metric): 1005; Case Code (Imperial): 0402; Size Code: 0402; Min Operating Temperature: -55°C; Max Operating Temperature: 155°C; Tolerance: 1%; Package Quantity: 1; Packaging: Tape and Reel; Resistor Type: Thick Film; Number of Terminations: 2; Termination: SMD/SMT; Voltage Rating (DC): 50V; Features: Moisture Resistant; Series: RC; Technology: THICK FILM; Resistance Tolerance: 1%; Construction: Rectangular; Length: 1mm; Width: 0.02inch; Height: 0.016inch; Depth: 0.5mm; RoHS Compliant: Yes; Reach SVHC Compliant: Yes; Military Standard: Not; Lead Free: Lead Free; ComponentLink1URL: https://datasheet.ciiva.com/11808/0900766b80c66297-11808454.pdf?src-supplier=RSComponents; ComponentLink1Description: https://datasheet.ciiva.com/11808/0900766b80c66297-11808454.pdf?src-supplier=RSComponents; ComponentLink2URL: https://datasheet.ciiva.com/7983/1018594-7983511.pdf?src-supplier=Element14; ComponentLink2Description: https://datasheet.ciiva.com/7983/1018594-7983511.pdf?src-supplier=Element14; ComponentLink3URL: https://datasheet.ciiva.com/46394/1018594-46394974.pdf?src-supplier=Element14; ComponentLink3Description: https://datasheet.ciiva.com/46394/1018594-46394974.pdf?src-supplier=Element14; ComponentLink4URL: https://datasheet.ciiva.com/2453/pyu-r-int-thick-7-2453494.pdf?src-supplier=Digi-Key; ComponentLink4Description: https://datasheet.ciiva.com/2453/pyu-r-int-thick-7-2453494.pdf?src-supplier=Digi-Key; ComponentLink5URL: https://datasheet.ciiva.com/2453/pyu-r-int-thick-7-2453495.pdf?src-supplier=Digi-Key; ComponentLink5Description: https://datasheet.ciiva.com/2453/pyu-r-int-thick-7-2453495.pdf?src-supplier=Digi-Key; ComponentLink6URL: https://datasheet.ciiva.com/2453/pyu-r-int-thick-7-2453493.pdf?src-supplier=Digi-Key; ComponentLink6Description: https://datasheet.ciiva.com/2453/pyu-r-int-thick-7-2453493.pdf?src-supplier=Digi-Key; ComponentLink7URL: https://datasheet.ciiva.com/12558/pyu-rc0402-51-rohs-l-6-r-8721-12558796.pdf?src-supplier=Mouser; ComponentLink7Description: https://datasheet.ciiva.com/12558/pyu-rc0402-51-rohs-l-6-r-8721-12558796.pdf?src-supplier=Mouser; Supplier Part Number 1: RC0402FR-0720KL; LCSC Part Number: C93942
SB3 = Solder Bridge 0402: Solder Bridge ON; Manufacturer Part Number: Solder Bridge 0402; Item Type: Solder Bridge
U18 = AP6256: 802.11ac/a/b/g/n WiFi Combo Sip Module (WiFi 5), 1T1R; Manufacturer: SparkLan; Item Type: IC; Manufacturer Part Number: AP6256; Footprint: Custom; ComponentLink1Description: Sparklan; ComponentLink1URL: https://www.sparklan.com/product/ap6256-broadcom-bcm43435-sip-module/
X1 = Q22FA12800078: 37.4MHz SMD Crystal Resonator 9pF 60Ω ±10ppm -40℃~+85℃ SMD2016-4P Crystals; Manufacturer: Seiko; Manufacturer Part Number: Q22FA12800078; Footprint: Custom; ComponentLink1Description: LCSC; ComponentLink1URL: https://www.lcsc.com/product-detail/Crystals_Seiko-Epson-Q22FA12800078_C255897.html; LCSC Part Number: C255897